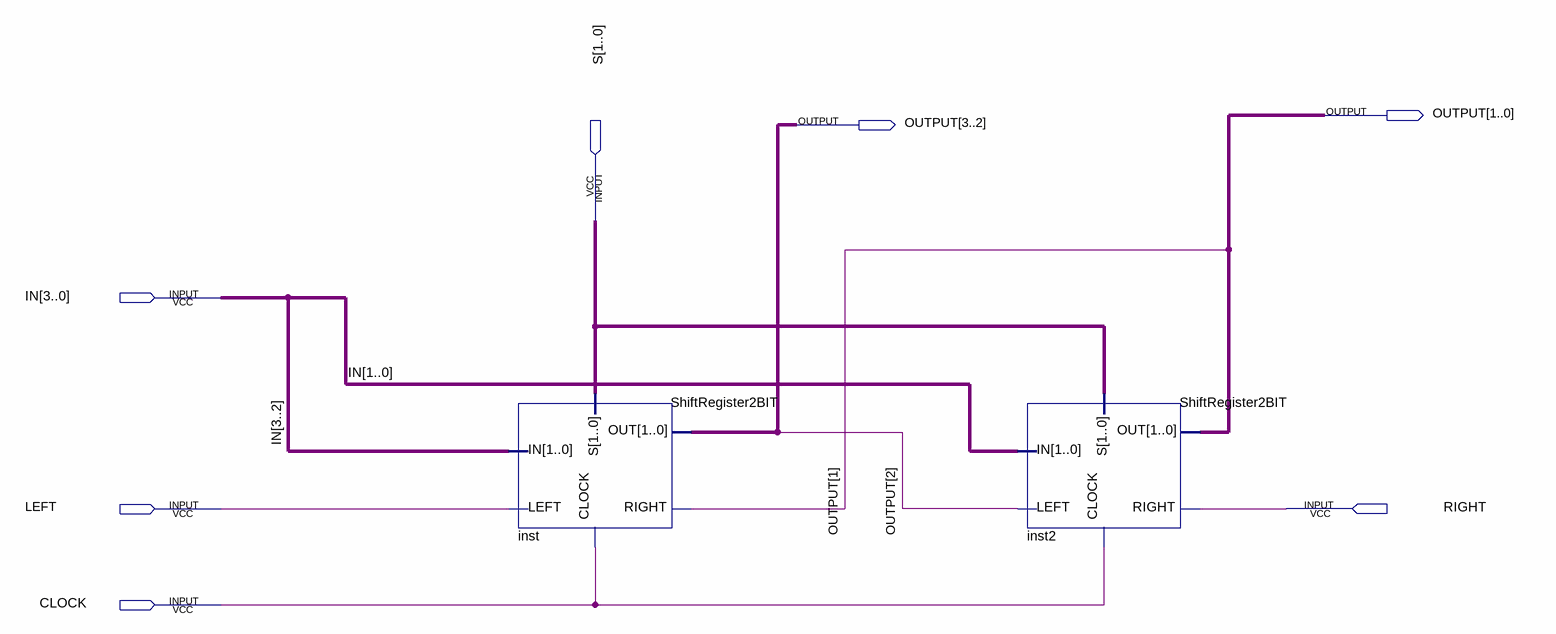
[diagram p0: schematic sheet]
// Quartus schematic ShiftRegister4BIT.bdf as structural Verilog: 2 symbols, 7 pins
module ShiftRegister4BIT (
  input  [1:0] S,
  input  [3:0] IN,
  input  LEFT,
  input  RIGHT,
  input  CLOCK,
  output [3:0] OUTPUT
);

  ShiftRegister2BIT inst (.S(S), .IN(IN[3:2]), .LEFT(LEFT), .RIGHT(OUTPUT[1]), .CLOCK(CLOCK), .OUT(OUTPUT[3:2]));
  ShiftRegister2BIT inst2 (.S(S), .IN(IN[1:0]), .LEFT(OUTPUT[2]), .RIGHT(RIGHT), .CLOCK(CLOCK), .OUT(OUTPUT[1:0]));
endmodule
